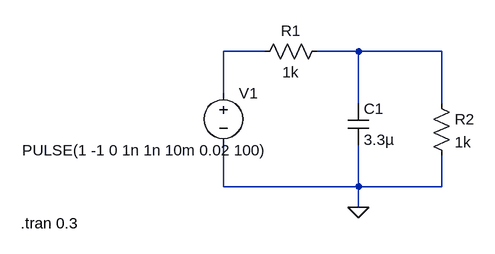
[diagram p0: schematic Task2b.asc]
Task2b.asc, the LTspice schematic file:
Version 4
SHEET 1 880 680
WIRE 144 48 80 48
WIRE 288 48 224 48
WIRE 416 48 288 48
WIRE 80 112 80 48
WIRE 288 128 288 48
WIRE 416 128 416 48
WIRE 80 256 80 192
WIRE 288 256 288 192
WIRE 288 256 80 256
WIRE 416 256 416 208
WIRE 416 256 288 256
WIRE 288 288 288 256
FLAG 288 288 0
SYMBOL voltage 80 96 R0
WINDOW 3 -310 104 Left 2
WINDOW 123 0 0 Left 0
WINDOW 39 0 0 Left 0
SYMATTR InstName V1
SYMATTR Value PULSE(1 -1 0 1n 1n 10m 0.02 100)
SYMBOL res 240 32 R90
WINDOW 0 0 56 VBottom 2
WINDOW 3 32 56 VTop 2
SYMATTR InstName R1
SYMATTR Value 1k
SYMBOL cap 272 128 R0
SYMATTR InstName C1
SYMATTR Value 3.3µ
SYMBOL res 400 112 R0
SYMATTR InstName R2
SYMATTR Value 1k
TEXT -232 312 Left 2 !.tran 0.3

The netlist it stands for:
* Task2b.asc
V1 N001 0 PULSE(1 -1 0 1n 1n 10m 0.02 100)
R1 N002 N001 1k
C1 N002 0 3.3µ
R2 N002 0 1k
.tran 0.3
.backanno
.end